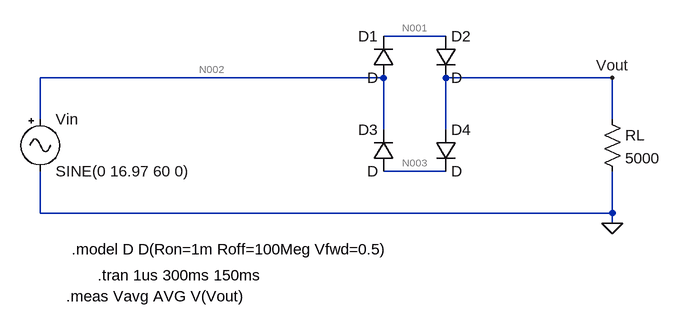
[diagram p0: schematic Exam 2 (Spring 2022) #1b (w-o Trafo).asc]
Exam 2 (Spring 2022) #1b (w-o Trafo).asc, the LTspice schematic file:
Version 4
SHEET 1 932 680
WIRE 592 80 496 80
WIRE 496 144 -32 144
WIRE 848 144 592 144
WIRE -32 208 -32 144
WIRE 848 208 848 144
WIRE 496 224 496 144
WIRE 592 224 592 144
WIRE 592 288 496 288
WIRE -32 352 -32 288
WIRE 848 352 848 288
WIRE 848 352 -32 352
WIRE 848 368 848 352
FLAG 848 368 0
FLAG 848 144 Vout
SYMBOL Misc\\signal -32 192 R0
WINDOW 123 0 0 Left 0
WINDOW 39 0 0 Left 0
SYMATTR InstName Vin
SYMATTR Value SINE(0 16.97 60 0)
SYMBOL diode 512 144 R180
WINDOW 0 24 64 Left 2
WINDOW 3 24 0 Left 2
SYMATTR InstName D1
SYMBOL diode 576 80 R0
SYMATTR InstName D2
SYMBOL diode 512 288 R180
WINDOW 0 24 64 Left 2
WINDOW 3 24 0 Left 2
SYMATTR InstName D3
SYMBOL diode 576 224 R0
SYMATTR InstName D4
SYMBOL res 832 192 R0
SYMATTR InstName RL
SYMATTR Value 5000
TEXT 16 408 Left 2 !.model D D(Ron=1m Roff=100Meg Vfwd=0.5)
TEXT 56 448 Left 2 !.tran 1us 300ms 150ms
TEXT 8 480 Left 2 !.meas Vavg AVG V(Vout)

The netlist it stands for:
* Exam 2 (Spring 2022) #1b (w-o Trafo).asc
Vin N002 0 SINE(0 16.97 60 0)
D1 N002 N001 D
D2 N001 Vout D
D3 N003 N002 D
D4 Vout N003 D
RL Vout 0 5000
.model D D
.lib standard.dio
.model D D(Ron=1m Roff=100Meg Vfwd=0.5)
.tran 1us 300ms 150ms
.meas Vavg AVG V(Vout)
.backanno
.end

* Results of the author's LTspice run, read from the files saved beside the schematic
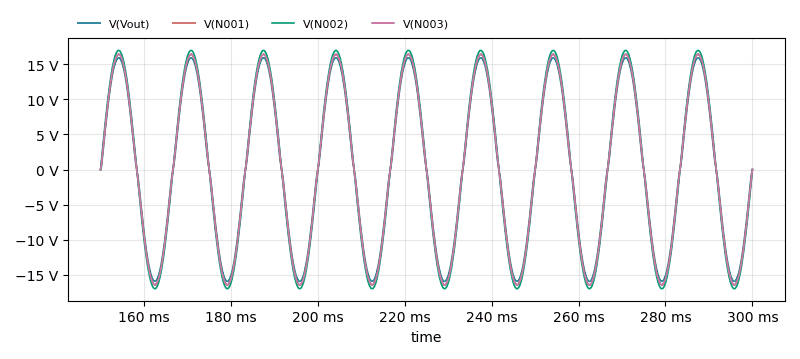
[diagram p1: Transient Analysis of Exam 2 (Spring 2022) #1b (w-o Trafo).asc, plotted from the saved traces]
* Transient Analysis, 1 run:
*   V(Vout): min -15.92 V, max 15.91 V, average -1.677 mV, rms 11.07 V, last 0 V
*   V(N001): min -16.42 V, max 16.41 V, average -951.6 µV, rms 11.52 V, last 0 V
*   V(N002): min -16.97 V, max 16.96 V, average -53.63 µV, rms 12 V, last 0 V
*   V(N003): min -16.42 V, max 16.41 V, average -951.6 µV, rms 11.52 V, last 0 V
* From the log:
*   vavg: AVG(v(vout))=-0.00167731 FROM 0 TO 0.15